# EAGLE design leaderboard (EAGLE 5.11)
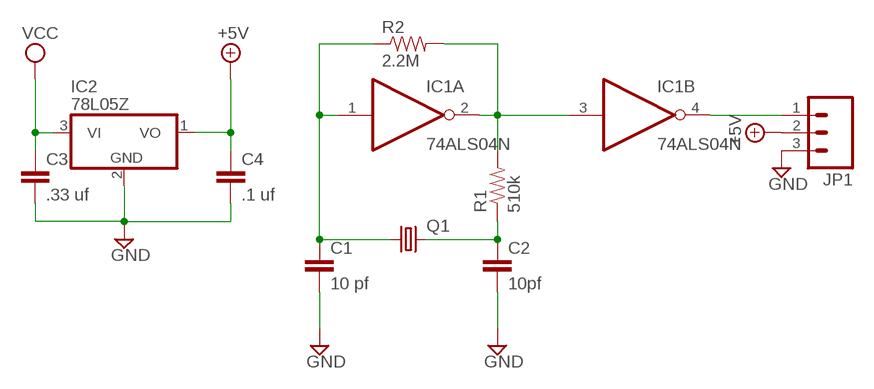
[diagram p0: schematic, sheet 1]

## Parts
C1  10 pf  CAPPTH  [CAP-PTH-SMALL]
C2  10pf  CAPPTH  [CAP-PTH-SMALL]
C3  .33 uf  CAPPTH1  [CAP-PTH-5MM]
C4  .1 uf  CAPPTH1  [CAP-PTH-5MM]
IC1  74ALS04N  [DIL14]
IC2  78L05Z  [TO92]
JP1  M03LOCK_LONGPADS  [1X03_LOCK_LONGPADS]
Q1  CRYSTALTC26H  [TC26H]
R1  510k  RESISTORPTH-1/6W  [1/6W-RES]
R2  2.2M  RESISTORPTH-1/6W  [1/6W-RES]

## Nets
+5V: C4.1 IC2.1(VO) JP1.2
GND: C1.2 C2.2 C3.2 C4.2 IC2.2(GND) JP1.3
N$1: C1.1 IC1.1(A:I) Q1.1 R2.1
N$2: C2.1 Q1.2 R1.1
N$3: IC1.2(A:O) IC1.3(B:I) R1.2 R2.2
N$4: IC1.4(B:O) JP1.1
VCC: C3.1 IC2.3(VI)
Unconnected: IC1.5(C:I) IC1.6(C:O) IC1.8(D:O) IC1.9(D:I) IC1.10(E:O) IC1.11(E:I) IC1.12(F:O) IC1.13(F:I)

## Power pins joined to a net without a drawn wire
GND: IC1.7(P:GND)
VCC: IC1.14(P:VCC)

## Library data of the parts
C1-C4 = SparkFun:CAP: Capacitor Standard 0603 ceramic capacitor, and 0.1" leaded capacitor.
IC1 = 74xx-us:74*04: Hex INVERTER
IC2 = linear:78*: Positive VOLTAGE REGULATOR Source: http://cache.national.com/ds/LM/LM78L05.pdf http://www.fairchildsemi.com/ds/LM/LM7805.pdf
JP1 = SparkFun:M03: Header 3 Standard 3-pin 0.1" header. Use with straight break away headers (SKU : PRT-00116), right angle break away headers (PRT-00553), swiss pins (PRT-00743), machine pins (PRT-00117), and female headers (PRT-00115). Molex polarized connector foot print use with SKU : PRT-08232 with associated crimp pins and housings.
Q1 = SparkFun:CRYSTAL: Crystals Various standard crystals. Proven footprints. Spark Fun Electronics SKU : COM-00534
R1 R2 = SparkFun:RESISTOR: Resistor Basic schematic elements and footprints for 0603, 1206, and PTH 1/10th watt (small) resistors.

## Board
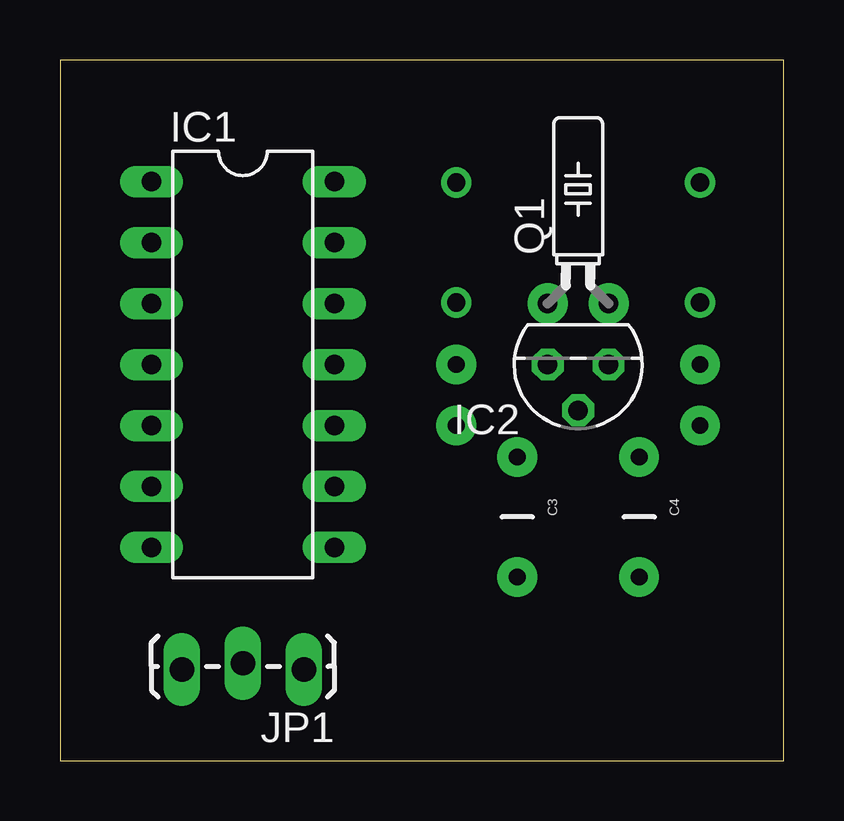
[diagram p1: board, top side]
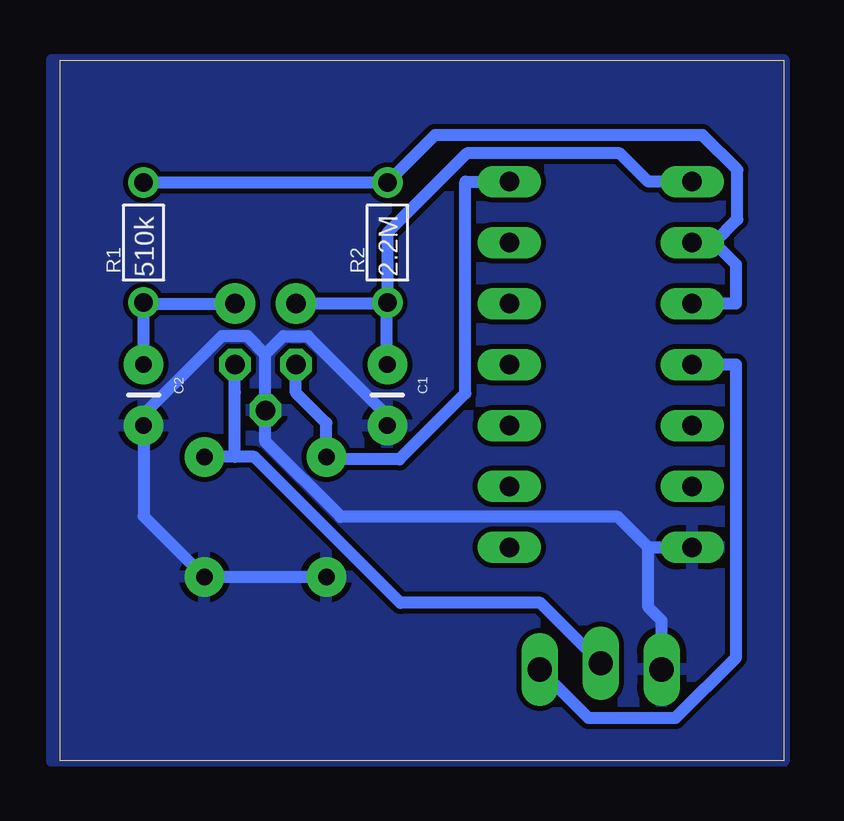
[diagram p2: board, bottom side, seen from below]

Size 30.15 x 29.2 mm. Coordinates in mm from the lower left corner, seen from the top.
Outline: 0,0 30.15,0 30.15,29.2 0,29.2 0,0
Copper layers (1*16): Top 0.035mm / dielectric 1.5mm / Bottom 0.035mm
Design rules "default *": minimum track width 10mil, minimum drill 24mil, track to track 8mil, track to pad 8mil, pad to pad 8mil, via to via 8mil, smd to smd 8mil, copper to edge 0mil, drill to drill 8mil, minimum pad ring 10mil, minimum via ring 8mil, stop-mask expansion 4mil, vias tented up to drill 0mil, thermal gap 10mil

### Footprints (pad centres in the part's own frame; a part is rotated, then mirrored left to right if it is on the bottom)
CAP-PTH-SMALL = drill 0.7 pad 1.651 round: 1 0,0; 2 2.54,0
CAP-PTH-5MM = drill 0.7 pad 1.651 round: 1 -2.5,0; 2 2.5,0
DIL14 = drill 0.813 long: 1 -7.62,-3.81; 2 -5.08,-3.81; 3 -2.54,-3.81; 4 0,-3.81; 5 2.54,-3.81; 6 5.08,-3.81; 7 7.62,-3.81; 8 7.62,3.81; 9 5.08,3.81; 10 2.54,3.81; 11 0,3.81; 12 -2.54,3.81; 13 -5.08,3.81; 14 -7.62,3.81
TO92 = drill 0.813 octagon: 1 -1.27,0; 2 0,1.905; 3 1.27,0
1X03_LOCK_LONGPADS = drill 1.016 long: 1 0,0; 2 2.54,-0.254; 3 5.08,0
TC26H = drill 0.813 pad 1.676 round: 1 -1.27,0; 2 1.27,0
1/6W-RES = drill 0.762 round: 1 -2.5,0; 2 2.5,0

### Placement (x,y rotation side)
C1  16.51,16.51 270 bottom
C2  26.67,16.51 270 bottom
C3  19.05,10.16 270 top
C4  24.13,10.16 270 top
IC1  7.62,16.51 270 top
IC2  21.59,16.51 180 top
JP1  10.16,3.81 180 top
Q1  21.59,19.05 0 top
R1  26.67,21.59 90 bottom
R2  16.51,21.59 90 bottom

### Tracks (layer width: path | path; a pad name or v marks a point on that pad's centre or on a via)
+5V
  Bottom 0.508: JP1.2 10.13,6.58 15.97,6.58 22.05,12.66 22.86,12.66 | 22.86,12.66 C4.1 | 22.86,12.66 22.86,15.34 IC2.1
GND
  Bottom 0.508: C3.2 C4.2 26.67,10.2 C2.2 26.67,14.43 23.41,17.69 22.33,17.69 21.59,16.95 | 21.59,16.95 IC2.2 21.59,13.29 18.46,10.16 6.91,10.16 5.64,8.89 | 21.59,16.95 20.85,17.69 19.82,17.69 16.51,14.38 C1.2 | 5.64,8.89 5.64,6.4 5.08,5.84 JP1.3 | 5.64,8.89 IC1.7
  pour Bottom: 0,29.21 0,0 30.48,0 30.48,29.21
N$1
  Bottom 0.508: 16.55,19.05 R2.1 16.51,22 13.2,25.31 6.82,25.31 5.64,24.13 IC1.1 | 16.55,19.05 Q1.1 | 16.55,19.05 16.55,16.55 C1.1
N$2
  Bottom 0.508: C2.1 26.67,19.05 | 26.67,19.05 R1.1 | 26.67,19.05 Q1.2
N$3
  Bottom 0.508: 2.9,21.59 1.93,22.55 1.93,24.62 3.39,26.07 14.53,26.07 R2.2 R1.2 | 2.9,21.59 1.98,20.68 1.98,19.05 IC1.3 | 2.9,21.59 IC1.2
N$4
  Bottom 0.508: IC1.4 1.98,16.51 1.98,4.3 4.5,1.78 8.13,1.78 JP1.1
VCC
  Bottom 0.508: IC1.14 13.26,24.13 13.26,15.31 16.01,12.56 18.95,12.56 C3.1 19.05,14.07 20.32,15.34 IC2.3